# Altium schematic sheet SUPPLY.SchDoc
size A4; SheetNumber: 6; SheetTotal: 7
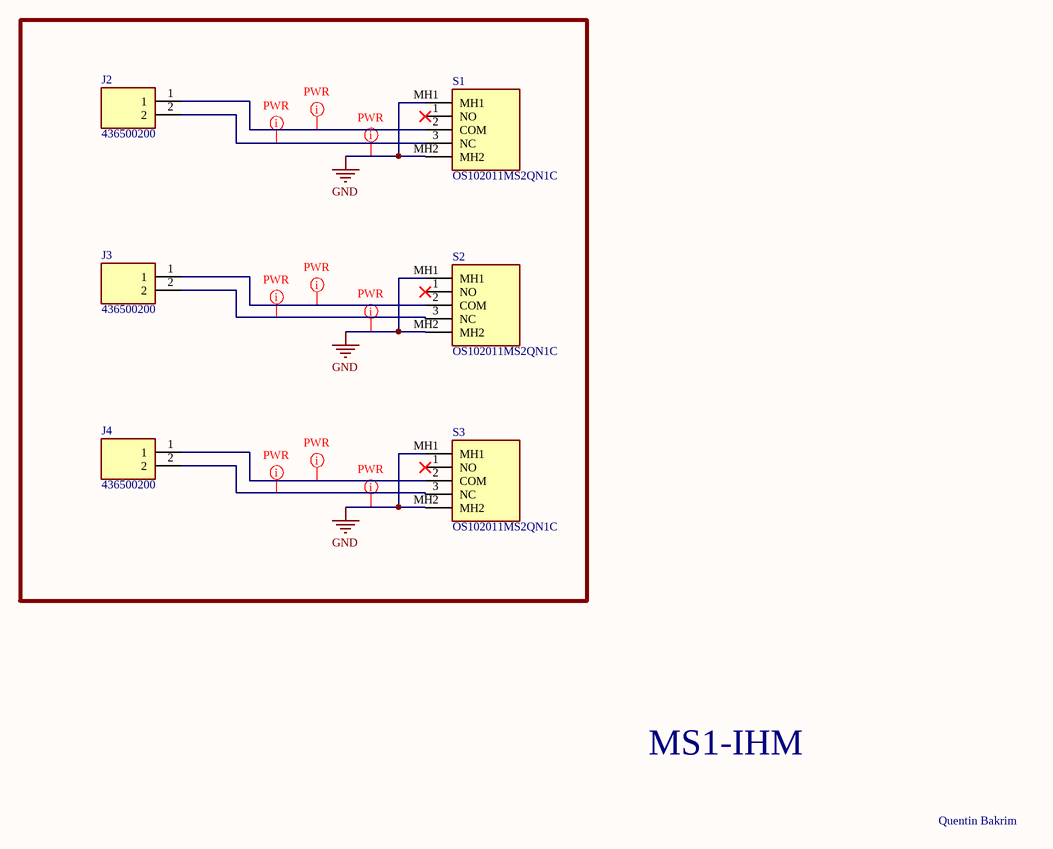
[diagram p0: SUPPLY.SchDoc]

## Parts
J2  436500200  [MOLEX_436500200]
J3  436500200  [MOLEX_436500200]
J4  436500200  [MOLEX_436500200]
S1  OS102011MS2QN1C  [OS102011MS2QN1C]
S2  OS102011MS2QN1C  [OS102011MS2QN1C]
S3  OS102011MS2QN1C  [OS102011MS2QN1C]

## Nets
GND: S1.MH1 S1.MH2 S2.MH1 S2.MH2 S3.MH1 S3.MH2
NetJ2_1: J2.1 S1.2(COM)
NetJ2_2: J2.2 S1.3(NC)
NetJ3_1: J3.1 S2.2(COM)
NetJ3_2: J3.2 S2.3(NC)
NetJ4_1: J4.1 S3.2(COM)
NetJ4_2: J4.2 S3.3(NC)

Not connected (* = marked no-connect by the designer): S1 1(NO)*; S2 1(NO)*; S3 1(NO)*

## Layout directives
net class PWR: (no net found under the mark), GND, NetJ2_1, NetJ2_2, NetJ3_1, NetJ3_2, NetJ4_1, NetJ4_2

## Notes on the sheet
- MS1-IHM
- Quentin Bakrim

## Library data of the parts
J2-J4 = 436500200: MF: {'manufacturer': u'Molex'}; MP: 436500200; Availability: Unavailable; Price: None; Value: *; Package: None
S1-S3 = OS102011MS2QN1C: Switch; Manufacturer_Name: C & K COMPONENTS; Datasheet Link: http://uk.rs-online.com/web/p/products/1546147; Height: 8.7mm; Manufacturer_Part_Number: OS102011MS2QN1C; Mouser Part Number: 611-OS102011MS2QN1C; Mouser Price/Stock: https://www.mouser.co.uk/ProductDetail/CK/OS102011MS2QN1C?qs=FgXbtR4Gg7KP4hs8ueQ7Wg%3D%3D